# EAGLE schematic nokia-phone-arduino-shield (EAGLE 6.5.0)
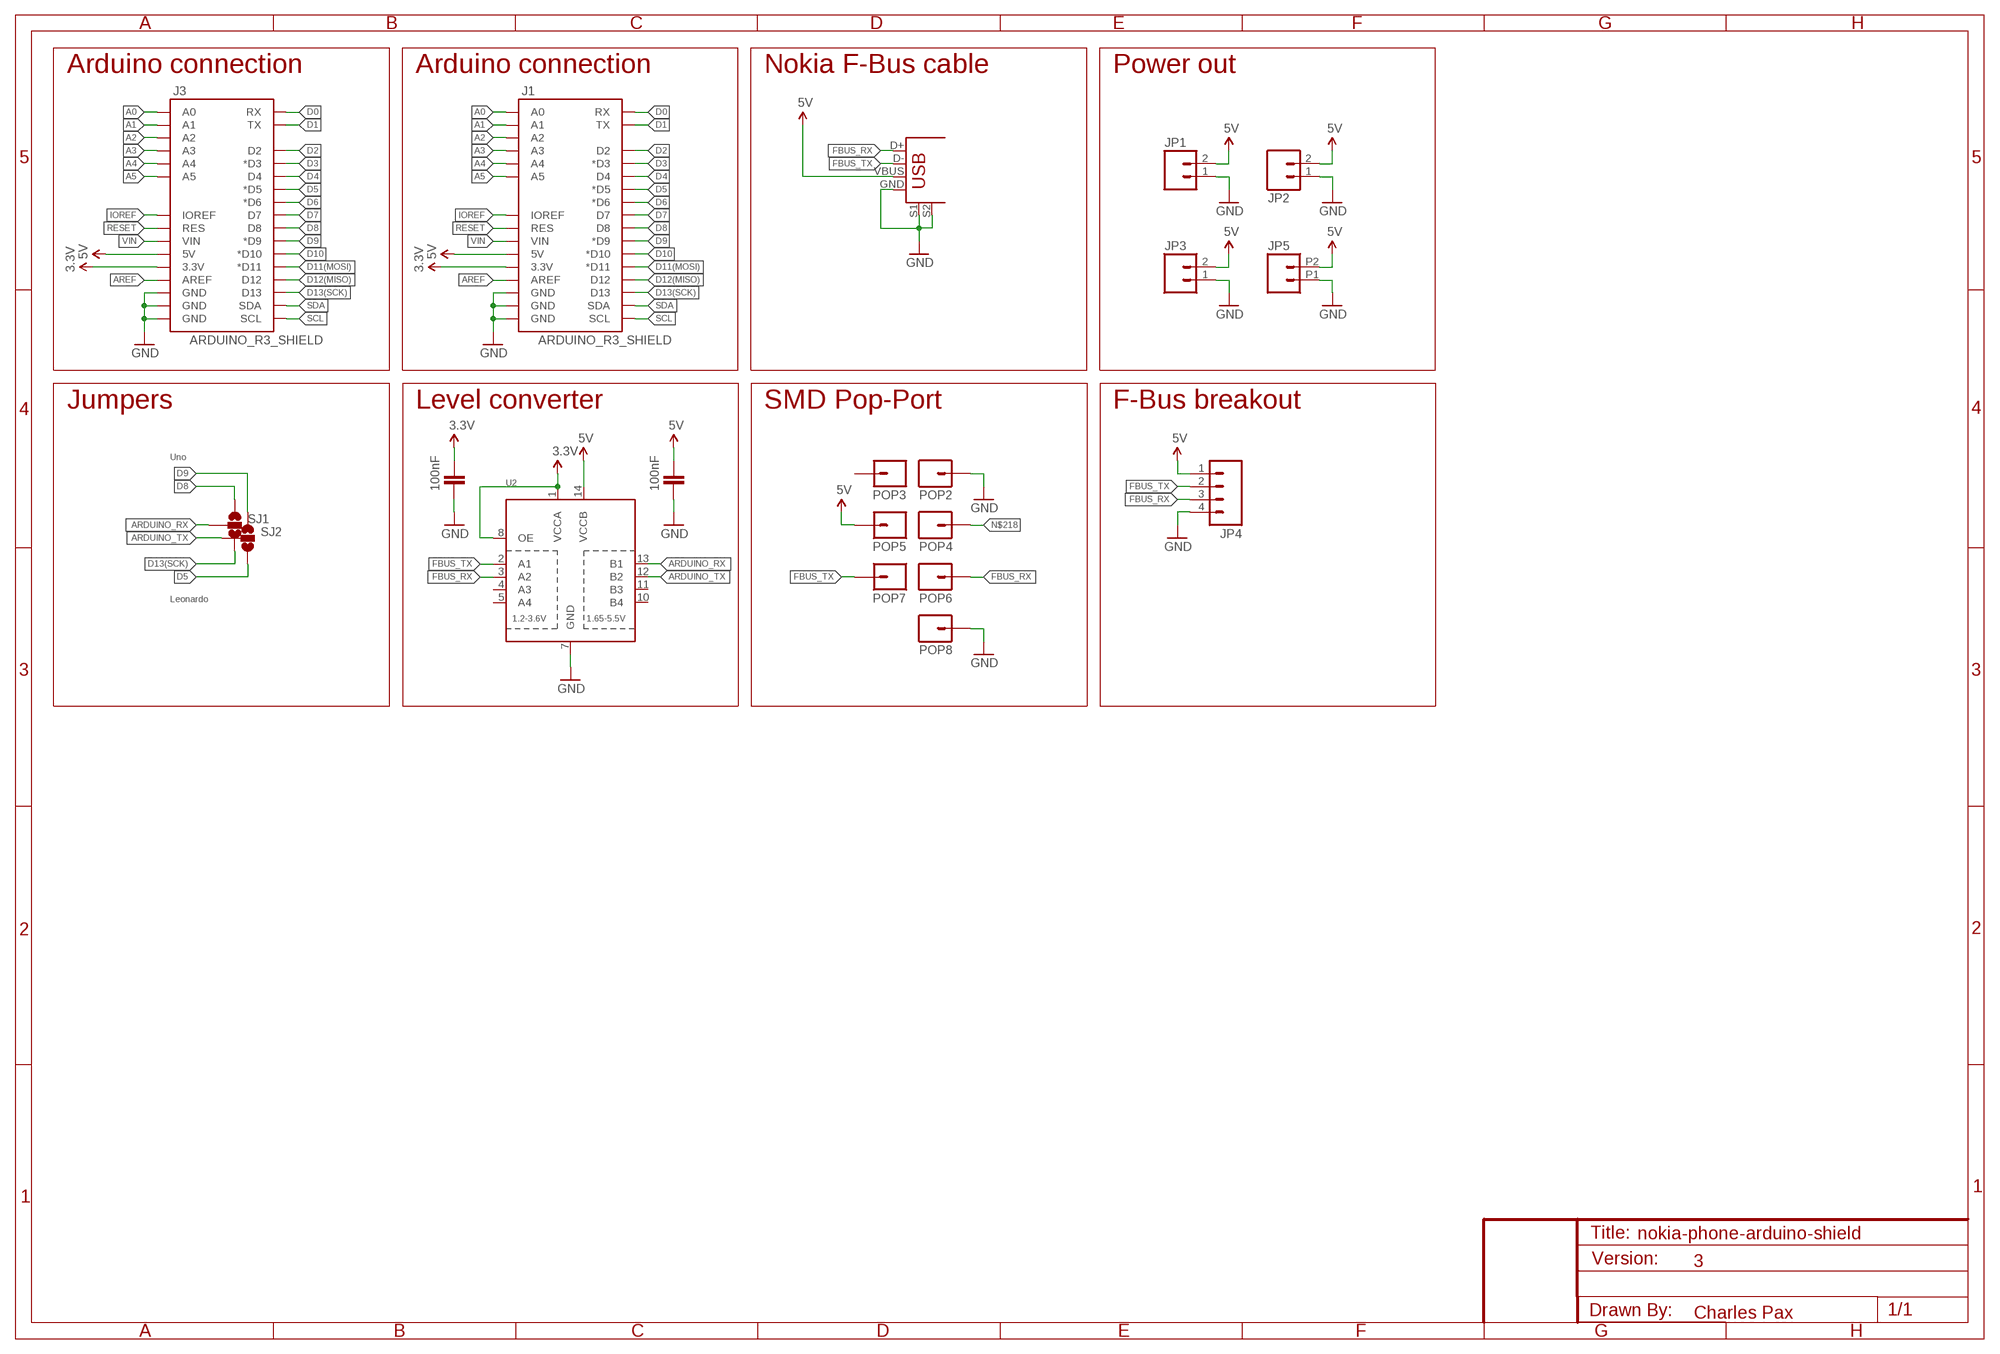
[diagram p0: schematic, sheet 1]

## Parts
C3  100nF  SPARKFUN-CAPACITORS_CAP0603-CAP  [SPARKFUN-CAPACITORS_0603-CAP]
C4  100nF  SPARKFUN-CAPACITORS_CAP0603-CAP  [SPARKFUN-CAPACITORS_0603-CAP]
J1  ARDUINO_R3_SHIELD  ARDUINO_R3_SHIELDUNO_R3_SHIELD_NOLABELS_LOCK  [UNO_R3_SHIELD_NOLABELS_LOCK]
J3  ARDUINO_R3_SHIELD  ARDUINO_R3_SHIELDUNO_R3_SHIELD_NOLABELS_LOCK  [UNO_R3_SHIELD_NOLABELS_LOCK]
JP1  M02LOCK  [1X02_LOCK]
JP2  M02-JST-2MM-SMT  [JST-2-SMD]
JP3  M02LOCK  [1X02_LOCK]
JP4  M04LOCK  [1X04_LOCK]
JP5  M022.54MM_SCREWTERM  [1X02_2.54_SCREWTERM]
POP2  M01SMD-4.5X1.5  [PAD-1.5X4.5]
POP3  M01SMD-4.5X1.5  [PAD-1.5X4.5]
POP4  M01SMD-4.5X1.5  [PAD-1.5X4.5]
POP5  M01SMD-4.5X1.5  [PAD-1.5X4.5]
POP6  M01SMD-4.5X1.5  [PAD-1.5X4.5]
POP7  M01SMD-4.5X1.5  [PAD-1.5X4.5]
POP8  M01SMD-4.5X1.5  [PAD-1.5X4.5]
SJ1  SOLDERJUMPER_2WAYS  [SJ_3]
SJ2  SOLDERJUMPER_2WAYS  [SJ_3]
U2  TXB0104PWRSOIC14  [SO14]
U$2  USB+SHIELDUSB-A-S-NOSILK-FEMALE  [USB-A-S-NOSILK-FEMALE]

## Nets
3.3V: C3.2 J1.3.3V J3.3.3V U2.1(VCCA) U2.8(OE)
5V: C4.2 J1.5V J3.5V JP1.2 JP2.2 JP3.2 JP4.1 JP5.P2 POP5.P$1 U2.14(VCCB) U$2.VBUS
A0: J1.A0 J3.A0
A1: J1.A1 J3.A1
A2: J1.A2 J3.A2
A3: J1.A3 J3.A3
A4: J1.A4 J3.A4
A5: J1.A5 J3.A5
ARDUINO_RX: SJ1.2 U2.13(B1)
ARDUINO_TX: SJ2.2 U2.12(B2)
AREF: J1.AREF J3.AREF
D0: J1.RX J3.RX
D1: J1.TX J3.TX
D2: J1.D2 J3.D2
D3: J1.D3(*D3) J3.D3(*D3)
D4: J1.D4 J3.D4
D5: J1.D5(*D5) J3.D5(*D5) SJ2.3
D6: J1.D6(*D6) J3.D6(*D6)
D7: J1.D7 J3.D7
D8: J1.D8 J3.D8 SJ1.1
D9: J1.D9(*D9) J3.D9(*D9) SJ2.1
D10: J1.D10(*D10) J3.D10(*D10)
D11(MOSI): J1.D11(*D11) J3.D11(*D11)
D12(MISO): J1.D12 J3.D12
D13(SCK): J1.D13 J3.D13 SJ1.3
FBUS_RX: JP4.3 POP6.P$1 U2.3(A2) U$2.D+
FBUS_TX: JP4.2 POP7.P$1 U2.2(A1) U$2.D-
GND: C3.1 C4.1 J1.GND@0(GND) J1.GND@1(GND) J1.GND@2(GND) J3.GND@0(GND) J3.GND@1(GND) J3.GND@2(GND) JP1.1 JP2.1 JP3.1 JP4.4 JP5.P1 POP2.P$1 POP8.P$1 U2.7(GND) U$2.GND U$2.S1 U$2.S2
IOREF: J1.IOREF J3.IOREF
N$218: POP4.P$1
RESET: J1.RES J3.RES
SCL: J1.SCL J3.SCL
SDA: J1.SDA J3.SDA
VIN: J1.VIN J3.VIN
Unconnected: POP3.P$1 U2.4(A3) U2.5(A4) U2.10(B4) U2.11(B3)

## Notes on the sheet
- Arduino connection | Arduino connection | Nokia F-Bus cable | Power out
- Jumpers | Level converter | SMD Pop-Port | F-Bus breakout
- Uno
- Leonardo
- 3
- Charles Pax

## Library data of the parts
C3 C4 = PaxInstrument-T400:SPARKFUN-CAPACITORS_CAP: Capacitor Standard 0603 ceramic capacitor, and 0.1" leaded capacitor.; MPN: CL10B104KO8NNNC; OC_DIGIKEY: 1276-1005-2-ND
J1 J3 = SparkFun-Boards:ARDUINO_R3_SHIELD: Shield form compatible with the Arduino Uno R3.
JP1 JP3 JP5 = SparkFun-Connectors:M02: Standard 2-pin 0.1" header. Use with - straight break away headers ( PRT-00116) - right angle break away headers (PRT-00553) - swiss pins (PRT-00743) - machine pins (PRT-00117) - female headers (PRT-00115) Molex polarized connector foot print use with: PRT-08233 with associated crimp pins and housings. 2.54_SCREWTERM for use with PRT-10571. 3.5mm Screw Terminal footprints for PRT-08084 5mm Screw Terminal footprints for use with PRT-08432
JP2 = SparkFun-Connectors:M02: Standard 2-pin 0.1" header. Use with - straight break away headers ( PRT-00116) - right angle break away headers (PRT-00553) - swiss pins (PRT-00743) - machine pins (PRT-00117) - female headers (PRT-00115) Molex polarized connector foot print use with: PRT-08233 with associated crimp pins and housings. 2.54_SCREWTERM for use with PRT-10571. 3.5mm Screw Terminal footprints for PRT-08084 5mm Screw Terminal footprints for use with PRT-08432; PROD_ID: CONN-11443
JP4 = SparkFun-Connectors:M04: Header 4 Standard 4-pin 0.1" header. Use with straight break away headers (SKU : PRT-00116), right angle break away headers (PRT-00553), swiss pins (PRT-00743), machine pins (PRT-00117), and female headers (PRT-00115). Molex polarized connector foot print use with SKU : PRT-08231 with associated crimp pins and housings. 1MM SMD Version SKU: PRT-10208
POP2-POP8 = SparkFun-Connectors:M01: Header 1 Standard 1-pin 0.1" header. Use with straight break away headers (SKU : PRT-00116), right angle break away headers (PRT-00553), swiss pins (PRT-00743), machine pins (PRT-00117), and female headers (PRT-00115).
SJ1 SJ2 = SparkFun-Retired:SOLDERJUMPER_2WAY: Solder Jumper 2 way solder jumper
U2 = SparkFun-DigitalIC:TXB0104PWR: 4-Bit Bi-Directional Level Shifter 1.2V-3.6V (VCCA) to 1.65V-5.5V (VCCB) bi-directional level shifter with auto direction sensing. Max data rate - VCCA 1.8V: 20Mbps (50ns), VCCA 3.3V: 100Mbps (10ns) Digikey: 296-21929-1-ND (TSSOP) IC-11329; MPN: TXB0104DR; OC_DIGIKEY: 296-21928-2-ND; PROD_ID: IC-11329
U$2 = SparkFun-Connectors:USB+SHIELD: USB+Shield USB connector with shield pins connectable

## Net classes
0 default: width 0.203 mm, drill 0.33 mm
1 power: width 0.305 mm